# EAGLE design nixie2x1 (EAGLE 4.16)
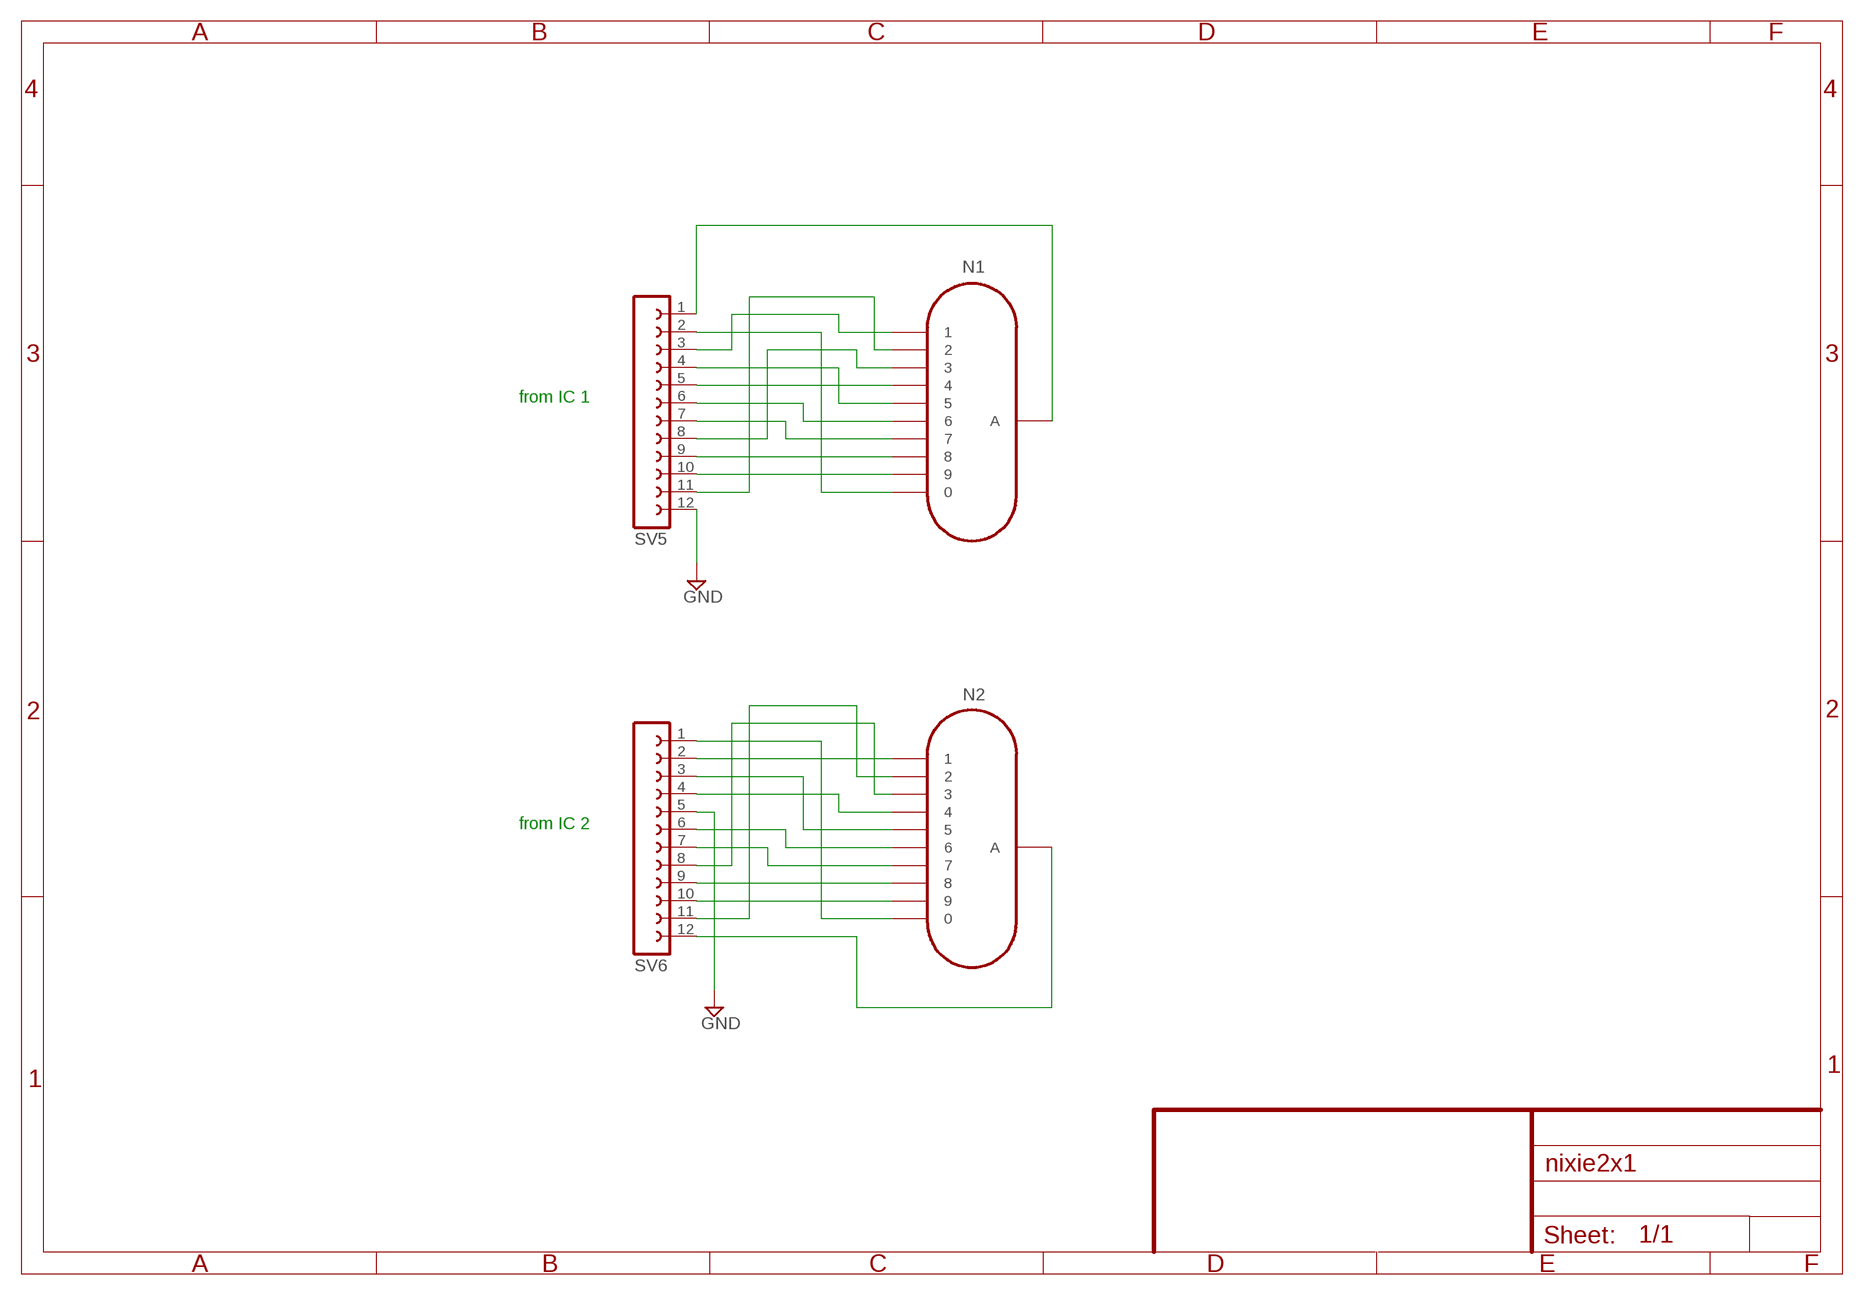
[diagram p0: schematic, sheet 1]

## Parts
N1  IN-12A  [IN-12]
N2  IN-12A  [IN-12]
SV5  FE12-1  [FE12]
SV6  FE12-1  [FE12]

## Nets
GND: SV5.12 SV6.5
N$1: N2.1 SV6.2
N$2: N2.5 SV6.3
N$3: N2.4 SV6.4
N$5: N2.6 SV6.6
N$6: N2.7 SV6.7
N$7: N2.3 SV6.8
N$8: N2.8 SV6.9
N$9: N2.9 SV6.10
N$10: N2.2 SV6.11
N$11: N2.A SV6.12
N$21: N1.A SV5.1
N$26: N2.0 SV6.1
N$27: N1.0 SV5.2
N$28: N1.1 SV5.3
N$29: N1.5 SV5.4
N$30: N1.4 SV5.5
N$31: N1.6 SV5.6
N$32: N1.7 SV5.7
N$33: N1.3 SV5.8
N$34: N1.8 SV5.9
N$35: N1.9 SV5.10
N$36: N1.2 SV5.11

## Notes on the sheet
- from IC 1
- from IC 2

## Library data of the parts
N1 N2 = russian-nixies:IN-12A: IN-12A: medium numeric topview nixie tube
SV5 SV6 = con-lsta:FE12-1: FEMALE HEADER

## Net classes
1 power: width 0.762 mm, drill 0.508 mm

## Board
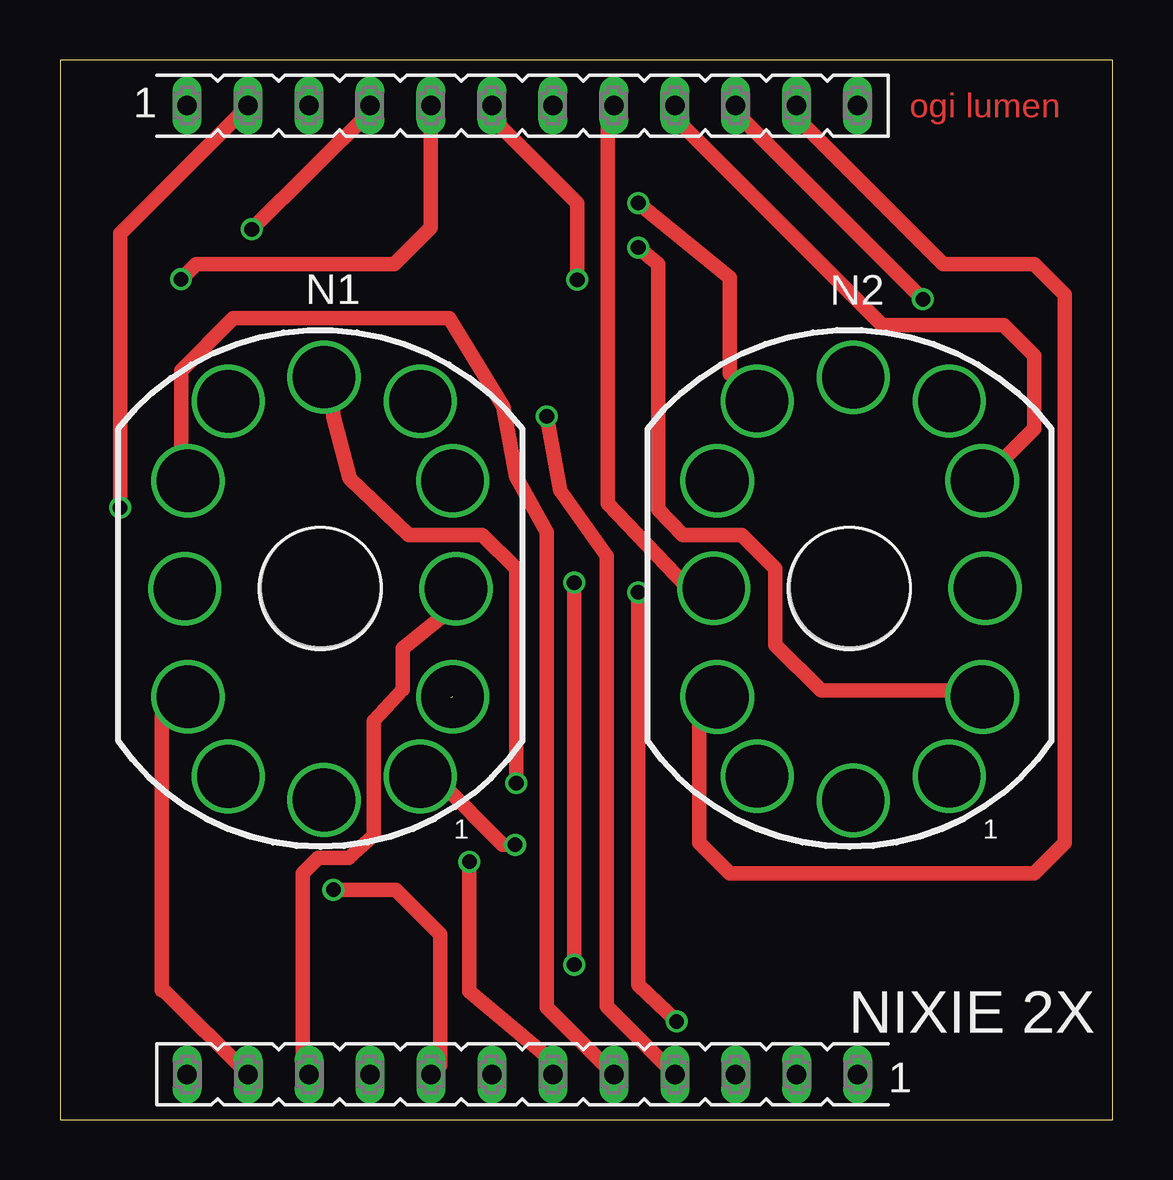
[diagram p1: board, top side]
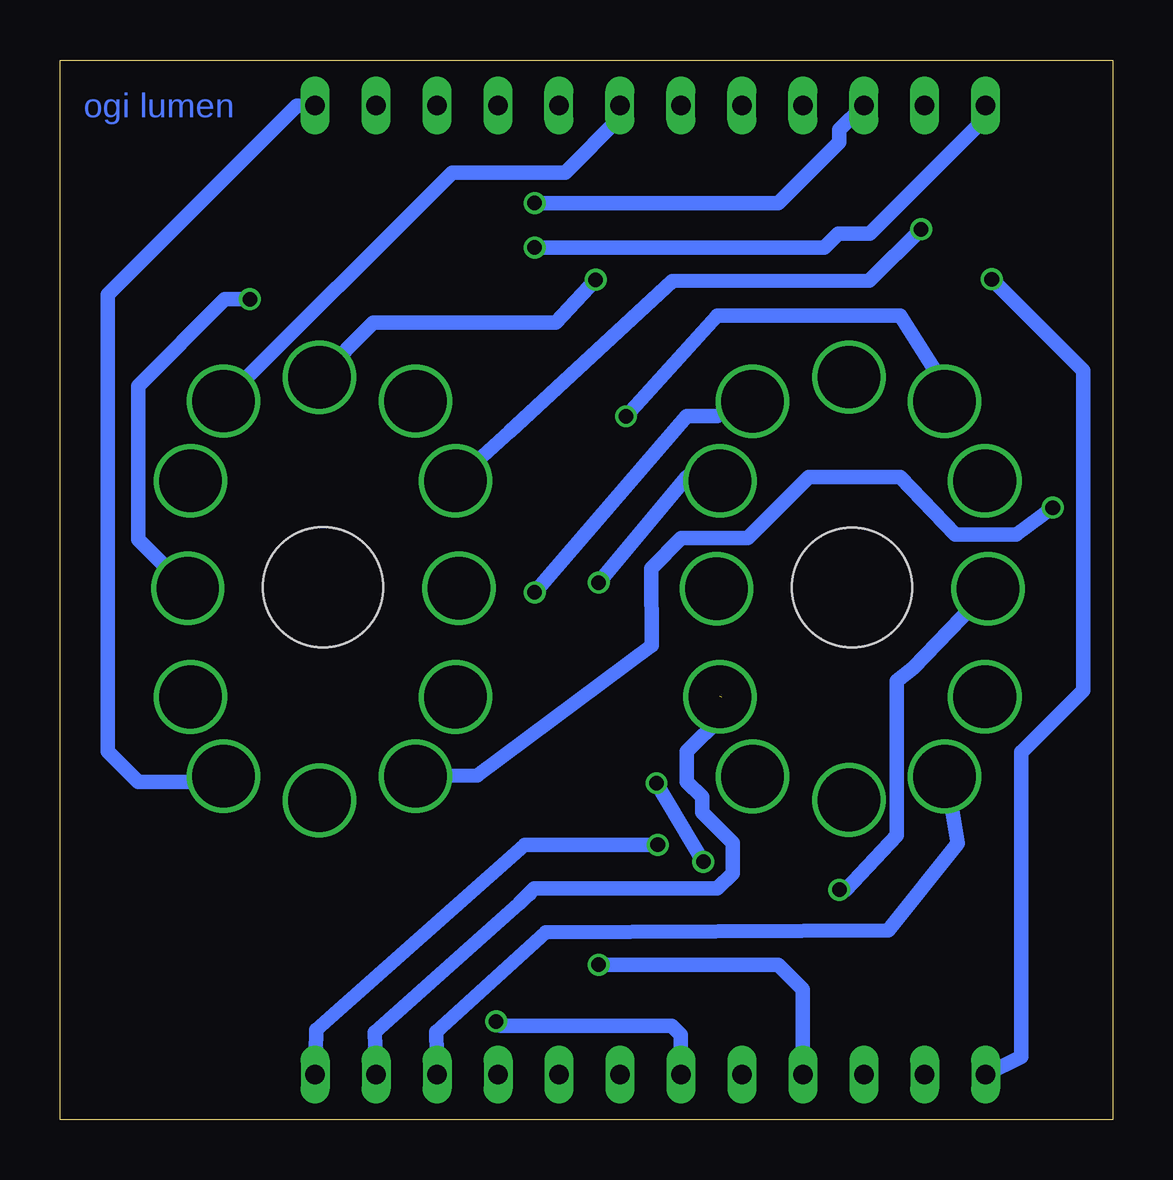
[diagram p2: board, bottom side, seen from below]

Size 43.87 x 44.19 mm. Coordinates in mm from the lower left corner, seen from the top.
Outline: 0,0 43.87,0 43.87,44.19 0,44.19 0,0
Copper layers (1*16): Top 0.035mm / dielectric 1.5mm / Bottom 0.035mm
Design rules "nixiespec": minimum track width 8mil, minimum drill 24mil, track to track 8mil, track to pad 8mil, pad to pad 8mil, via to via 12mil, smd to smd 8mil, copper to edge 40mil, drill to drill 8mil, minimum pad ring 0.1mm, minimum via ring 0.1mm, stop-mask expansion 4mil, vias tented up to drill 0mil, thermal gap 10mil

### Footprints (pad centres in the part's own frame; a part is rotated, then mirrored left to right if it is on the bottom)
IN-12 = drill 2.591 pad 3.048 round: 0 5.505,-4.551; 1 -3.86,-7.868; 2 -5.543,-4.551; 3 -5.67,-0.051; 4 -5.543,4.449; 5 -3.86,7.767; 6 0.14,8.767; 7 4.14,7.767; 8 5.505,4.449; 9 5.632,-0.051; A 4.14,-7.868; LHDP 0.14,-8.868 | hole 5: 0,0
FE12 = drill 0.813 long: 1 -13.97,0; 2 -11.43,0; 3 -8.89,0; 4 -6.35,0; 5 -3.81,0; 6 -1.27,0; 7 1.27,0; 8 3.81,0; 9 6.35,0; 10 8.89,0; 11 11.43,0; 12 13.97,0

### Placement (x,y rotation side)
N1  10.87,22.2 0 top
N2  32.91,22.2 0 top
SV5  19.27,1.9 180 top
SV6  19.27,42.29 0 top

### Tracks (layer width: path | path; a pad name or v marks a point on that pad's centre or on a via)
GND  (via drill 0.61)
  Top 0.61: SV6.5 15.46,37.21 13.93,35.68 5.68,35.68 v5.04,35.05
  Bottom 0.203: 3.82,15.34 3.77,15.36
  Bottom 0.61: 3.82,15.34 3.82,2.64 SV5.12 | 3.77,15.36 1.23,17.9 1.23,31.24 v5.04,35.05
N$1  (via drill 0.61)
  Top 0.61: v2.5,25.52 2.5,36.95 SV6.2
  Bottom 0.61: v2.5,25.52 4.03,24.4 6.57,24.4 8.85,26.79 12.66,26.79 15.2,24.25 17.97,24.25 19.24,22.98 19.21,19.78 26.48,14.37 N2.1
N$2  (via drill 0.61)
  Top 0.61: v24.09,38.22 27.9,35.11 27.9,31.12 N2.5
  Bottom 0.61: v24.09,38.22 13.93,38.22 11.39,40.76 11.39,41.27 SV6.3
N$3  (via drill 0.61)
  Top 0.61: v7.99,37.13 12.99,42.08 SV6.4
  Bottom 0.61: v7.99,37.13 10.15,35 18.35,34.97 25.13,28.7 N2.4
N$4  (via drill 2.59 pad 3.05)
  other vias: 7.01,29.95
N$5  (via drill 0.61)
  Top 0.61: v21.55,35.02 21.55,38.22 18,41.78 SV6.6
  Bottom 0.61: v21.55,35.02 23.2,33.24 30.82,33.24 N2.6
N$6
  Bottom 0.61: SV6.7 20.54,41.78 22.82,39.49 27.53,39.49 N2.7
N$7
  Top 0.61: N2.3 26.07,22.27 22.82,25.7 22.82,42.03 SV6.8
N$8
  Top 0.61: SV6.9 25.62,41.78 34.25,33.14 39.33,33.14 40.6,31.87 40.6,28.83 N2.8
N$9  (via drill 0.61)
  Top 0.61: SV6.10 28.16,42.01 v35.95,34.21
  Bottom 0.61: v35.95,34.21 37,34.21 40.6,30.6 40.6,24.2 N2.9
N$10
  Top 0.61: N2.2 26.63,16.91 26.63,11.55 27.9,10.28 40.6,10.28 41.87,11.55 41.87,34.41 40.6,35.68 36.79,35.68 30.7,41.78 SV6.11
N$11
  Bottom 0.61: N2.A 37.29,14.09 40.6,14.09 41.87,15.36 41.87,34.41 34,42.29 SV6.12
N$12  (via drill 2.59 pad 3.05)
  other vias: 10.99,30.97
N$13  (via drill 2.59 pad 3.05)
  other vias: 15.01,29.95
N$14  (via drill 2.59 pad 3.05)
  other vias: 16.36,26.64
N$15  (via drill 2.59 pad 3.05)
  other vias: 16.51,22.16
N$16  (via drill 2.59 pad 3.05)
  other vias: 5.35,26.64
N$17  (via drill 2.59 pad 3.05)
  other vias: 5.19,22.16
N$18  (via drill 2.59 pad 3.05)
  other vias: 5.35,17.64
N$19  (via drill 2.59 pad 3.05)
  other vias: 7.01,14.31
N$20  (via drill 2.59 pad 3.05)
  other vias: 10.99,13.36
N$21  (via drill 0.61)
  Top 0.61: v18.96,11.48 18.45,11.48 15.84,14.09 15.24,14.09 N1.A
  Bottom 0.61: v18.96,11.48 24.5,11.48 33.19,3.75 SV5.1
N$22  (via drill 2.59 pad 3.05)
  other vias: 15.01,14.31
N$23  (via drill 2.59 pad 3.05)
  other vias: 16.36,17.64
N$24  (via drill 2.59 pad 3.05)
  other vias: 33.06,30.96
N$25  (via drill 2.59 pad 3.05)
  other vias: 37.05,29.97
N$26  (via drill 0.61)
  Top 0.61: v24.09,36.37 24.93,35.68 24.93,25.45 25.95,24.38 28.41,24.38 29.81,22.98 29.81,19.81 31.71,17.9 38.17,17.9 N2.0
  Bottom 0.61: v24.09,36.37 12.03,36.37 11.44,36.95 10.12,36.95 5.3,41.78 SV6.1
N$27  (1 unrouted)
  Bottom 0.61: 24.74,9.02 30.75,3.65 SV5.2 | 24.74,9.02 24.29,9.42 | 16.29,17.62 16.29,16.81 17.74,15.36 17.74,14.09 17.11,13.46 17.11,12.82 15.84,11.55 15.84,10.28 16.47,9.65 24.11,9.65 24.74,9.02
N$28
  Bottom 0.203: 6.92,14.27 N1.1
  Bottom 0.61: 6.92,14.27 6.46,11.53 9.36,7.89 23.63,7.82 28.18,3.68 SV5.3
N$29  (via drill 0.61)
  Top 0.61: v20.28,29.33 20.84,26.23 22.77,23.52 22.77,4.75 SV5.4
  Bottom 0.61: v20.28,29.33 16.47,33.52 8.85,33.52 6.87,30.4 N1.5
N$30
  Top 0.61: SV5.5 20.28,4.69 20.28,24.51 19.01,26.79 18.48,29.74 16.22,33.42 7.23,33.42 5.04,31.24 5.04,26.93 N1.4
N$31  (via drill 0.61)
  Top 0.203: SV5.6 20.28,2.66
  Top 0.61: 20.28,2.66 17.06,5.35 v17.06,10.77 | v19.01,14.04 19.01,22.98 17.6,24.39 14.53,24.39 12.08,26.73 11.39,29.33 11.39,30.6 N1.6
  Bottom 0.61: v17.06,10.77 v19.01,14.04
N$32  (via drill 0.61)
  Top 0.61: v25.69,4.11 24.09,5.63 v24.09,21.99
  Bottom 0.61: v24.09,21.99 17.74,29.33 16.47,29.33 N1.7 | SV5.7 18,3.55 18.38,3.93 25.51,3.93 v25.69,4.11
N$33  (via drill 0.61)
  Top 0.61: v11.39,9.6 13.98,9.6 15.84,7.74 15.84,2.28 SV5.8
  Bottom 0.203: 5.3,21.99 N1.3
  Bottom 0.61: 5.3,21.99 8.32,18.84 9,18.3 9,11.86 11.12,9.6 v11.39,9.6
N$34  (via drill 0.61)
  Top 0.61: v21.43,6.47 v21.43,22.4
  Bottom 0.61: v21.43,22.4 17.74,26.79 N1.8 | SV5.9 12.92,5.46 13.93,6.47 v21.43,6.47
N$35
  Top 0.203: 16.55,22.27 N1.9
  Top 0.61: 16.55,22.27 16.57,22.25 17,21.86 14.29,19.66 14.29,17.94 13.07,16.63 13.07,11.87 12.03,10.92 10.76,10.92 10.12,10.28 10.12,2.15 SV5.10
N$36
  Top 0.61: N1.2 4.23,16.84 4.23,5.41 4.33,5.41 SV5.11
N$37  (via drill 2.59 pad 3.05)
  other vias: 38.44,26.64
N$38  (via drill 2.59 pad 3.05)
  other vias: 38.54,22.17
N$39  (via drill 2.59 pad 3.05)
  other vias: 38.44,17.62
N$40  (via drill 2.59 pad 3.05)
  other vias: 37.05,14.32
N$41  (via drill 2.59 pad 3.05)
  other vias: 33.06,13.3
N$42  (via drill 2.59 pad 3.05)
  other vias: 29.04,14.32
N$43  (via drill 2.59 pad 3.05)
  other vias: 27.39,17.62
N$44  (via drill 2.59 pad 3.05)
  other vias: 27.24,22.17
N$45  (via drill 2.59 pad 3.05)
  other vias: 27.39,26.64
N$46  (via drill 2.59 pad 3.05)
  other vias: 29.04,29.97

### Text on the board
Top: ogi lumen
Bottom: ogi lumen
tNames: NIXIE 2X